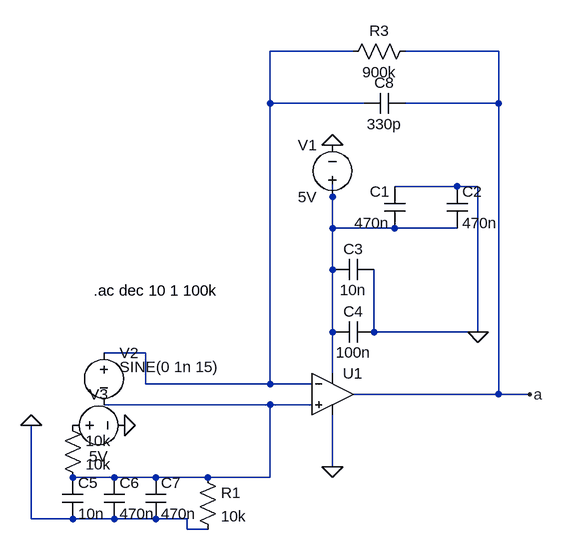
[diagram p0: schematic Draft12.asc]
Draft12.asc, the LTspice schematic file:
Version 4
SHEET 1 880 680
WIRE 320 -192 192 -192
WIRE 544 -192 400 -192
WIRE 192 -112 192 -192
WIRE 336 -112 192 -112
WIRE 544 -112 544 -192
WIRE 544 -112 400 -112
WIRE 480 16 384 16
WIRE 512 16 480 16
WIRE 288 32 288 0
WIRE 288 80 288 32
WIRE 384 80 288 80
WIRE 480 80 384 80
WIRE 288 144 288 80
WIRE 288 240 288 144
WIRE 352 240 352 144
WIRE 512 240 512 16
WIRE 512 240 352 240
WIRE 0 272 -64 272
WIRE 288 304 288 240
WIRE 0 320 0 272
WIRE 192 320 192 -112
WIRE 192 320 0 320
WIRE 256 320 192 320
WIRE 544 336 544 -112
WIRE 544 336 320 336
WIRE 592 336 544 336
WIRE 192 352 -64 352
WIRE 256 352 192 352
WIRE 288 448 288 368
WIRE -48 464 -112 464
WIRE 16 464 -48 464
WIRE 96 464 16 464
WIRE 192 464 192 352
WIRE 192 464 96 464
WIRE -176 528 -176 384
WIRE -112 528 -176 528
WIRE -48 528 -112 528
WIRE 16 528 -48 528
WIRE 64 528 16 528
WIRE 64 544 64 528
WIRE 96 544 64 544
FLAG 288 -48 0
FLAG 288 448 0
FLAG 512 240 0
FLAG -176 384 0
FLAG -32 384 0
FLAG 592 336 a
SYMBOL OpAmps/UniversalOpamp2 288 336 R0
SYMATTR InstName U1
SYMBOL voltage 288 48 R180
WINDOW 0 24 96 Left 2
WINDOW 3 24 16 Left 2
SYMATTR InstName V1
SYMATTR Value 5V
SYMBOL cap 400 80 R180
WINDOW 0 24 56 Left 2
WINDOW 3 24 8 Left 2
SYMATTR InstName C1
SYMATTR Value 470n
SYMBOL cap 288 160 R270
WINDOW 0 32 32 VTop 2
WINDOW 3 0 32 VBottom 2
SYMATTR InstName C3
SYMATTR Value 10n
SYMBOL cap 288 256 R270
WINDOW 0 32 32 VTop 2
WINDOW 3 0 32 VBottom 2
SYMATTR InstName C4
SYMATTR Value 100n
SYMBOL cap -128 464 R0
SYMATTR InstName C5
SYMATTR Value 10n
SYMBOL cap -64 464 R0
SYMATTR InstName C6
SYMATTR Value 470n
SYMBOL cap 0 464 R0
SYMATTR InstName C7
SYMATTR Value 470n
SYMBOL res 80 448 R0
SYMATTR InstName R1
SYMATTR Value 10k
SYMBOL res -128 368 R0
SYMATTR InstName 10k
SYMATTR Value 10k
SYMBOL res 416 -208 R90
WINDOW 0 0 56 VBottom 2
WINDOW 3 32 56 VTop 2
SYMATTR InstName R3
SYMATTR Value 900k
SYMBOL cap 400 -128 R90
WINDOW 0 0 32 VBottom 2
WINDOW 3 32 32 VTop 2
SYMATTR InstName C8
SYMATTR Value 330p
SYMBOL voltage -64 256 R0
WINDOW 3 24 38 Left 2
SYMATTR InstName V2
SYMATTR Value SINE(0 1n 15)
SYMBOL cap 464 16 R0
SYMATTR InstName C2
SYMATTR Value 470n
SYMBOL voltage -128 384 R270
WINDOW 0 32 56 VTop 2
WINDOW 3 -32 56 VBottom 2
SYMATTR InstName V3
SYMATTR Value 5V
TEXT -80 176 Left 2 !.ac dec 10 1 100k

The netlist it stands for:
* Draft12.asc
XU1 N003 N001 N002 0 a level.2 Avol=1Meg GBW=10Meg Slew=10Meg ilimit=25m rail=0 Vos=0 phimargin=45 en=0 enk=0 in=0 ink=0 Rin=500Meg  ; pins IN+ IN- V+ V- OUT
V1 N002 0 5V
C1 N002 0 470n
C3 N002 0 10n
C4 N002 0 100n
C5 N003 0 10n
C6 N003 0 470n
C7 N003 0 470n
R1 N003 0 10k
R§10k P001 N003 10k
R3 a N001 900k
C8 a N001 330p
V2 N001 N003 SINE(0 1n 15)
C2 0 N002 470n
V3 P001 0 5V
.ac dec 10 1 100k
.lib UniversalOpamps2.sub
.backanno
.end